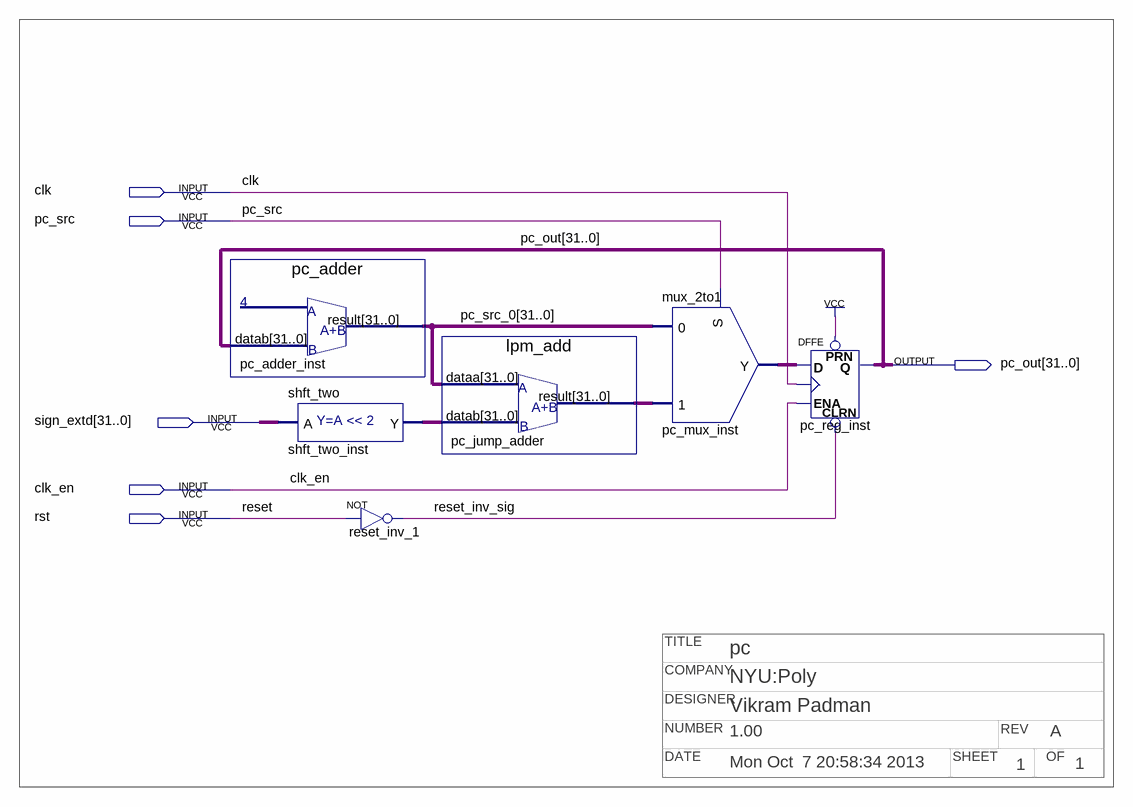
[diagram p0: schematic sheet]
// Quartus schematic pc.bdf as structural Verilog: 6 symbols, 6 pins
// Title block: COMPANY: NYU:Poly; DATE: Mon Oct  7 20:58:34 2013; DESIGNER: Vikram Padman; NUMBER: 1.00; OF: 1; REV: A; SHEET: 1; TITLE: pc
module pc (
  input  clk,
  input  pc_src,
  input  [31:0] sign_extd,
  input  clk_en,
  input  rst,
  output [31:0] pc_out
);

  wire reset_inv_sig;
  wire [31:0] pc_c2, pc_src_0, pc_src_1, sign_extd_shd;

  pc_adder pc_adder_inst (.datab(pc_out), .result(pc_src_0));
  shft_two shft_two_inst (.int_in(sign_extd), .int_out(sign_extd_shd));
  not reset_inv_1 (reset_inv_sig, rst);
  lpm_add pc_jump_adder (.dataa(pc_src_0), .datab(sign_extd_shd), .result(pc_src_1));
  mux_2to1 pc_mux_inst (.in_bus_1(pc_src_1), .in_bus_0(pc_src_0), .sel_input(pc_src), .out_bus(pc_c2));
  DFFE pc_reg_inst[31:0] (.PRN(1'b1), .CLRN(reset_inv_sig), .D(pc_c2), .CLK(clk), .ENA(clk_en), .Q(pc_out));

  // Other names for the same wires on the sheet: reset = rst
endmodule
